# EAGLE design dfx-main (EAGLE 5.11)
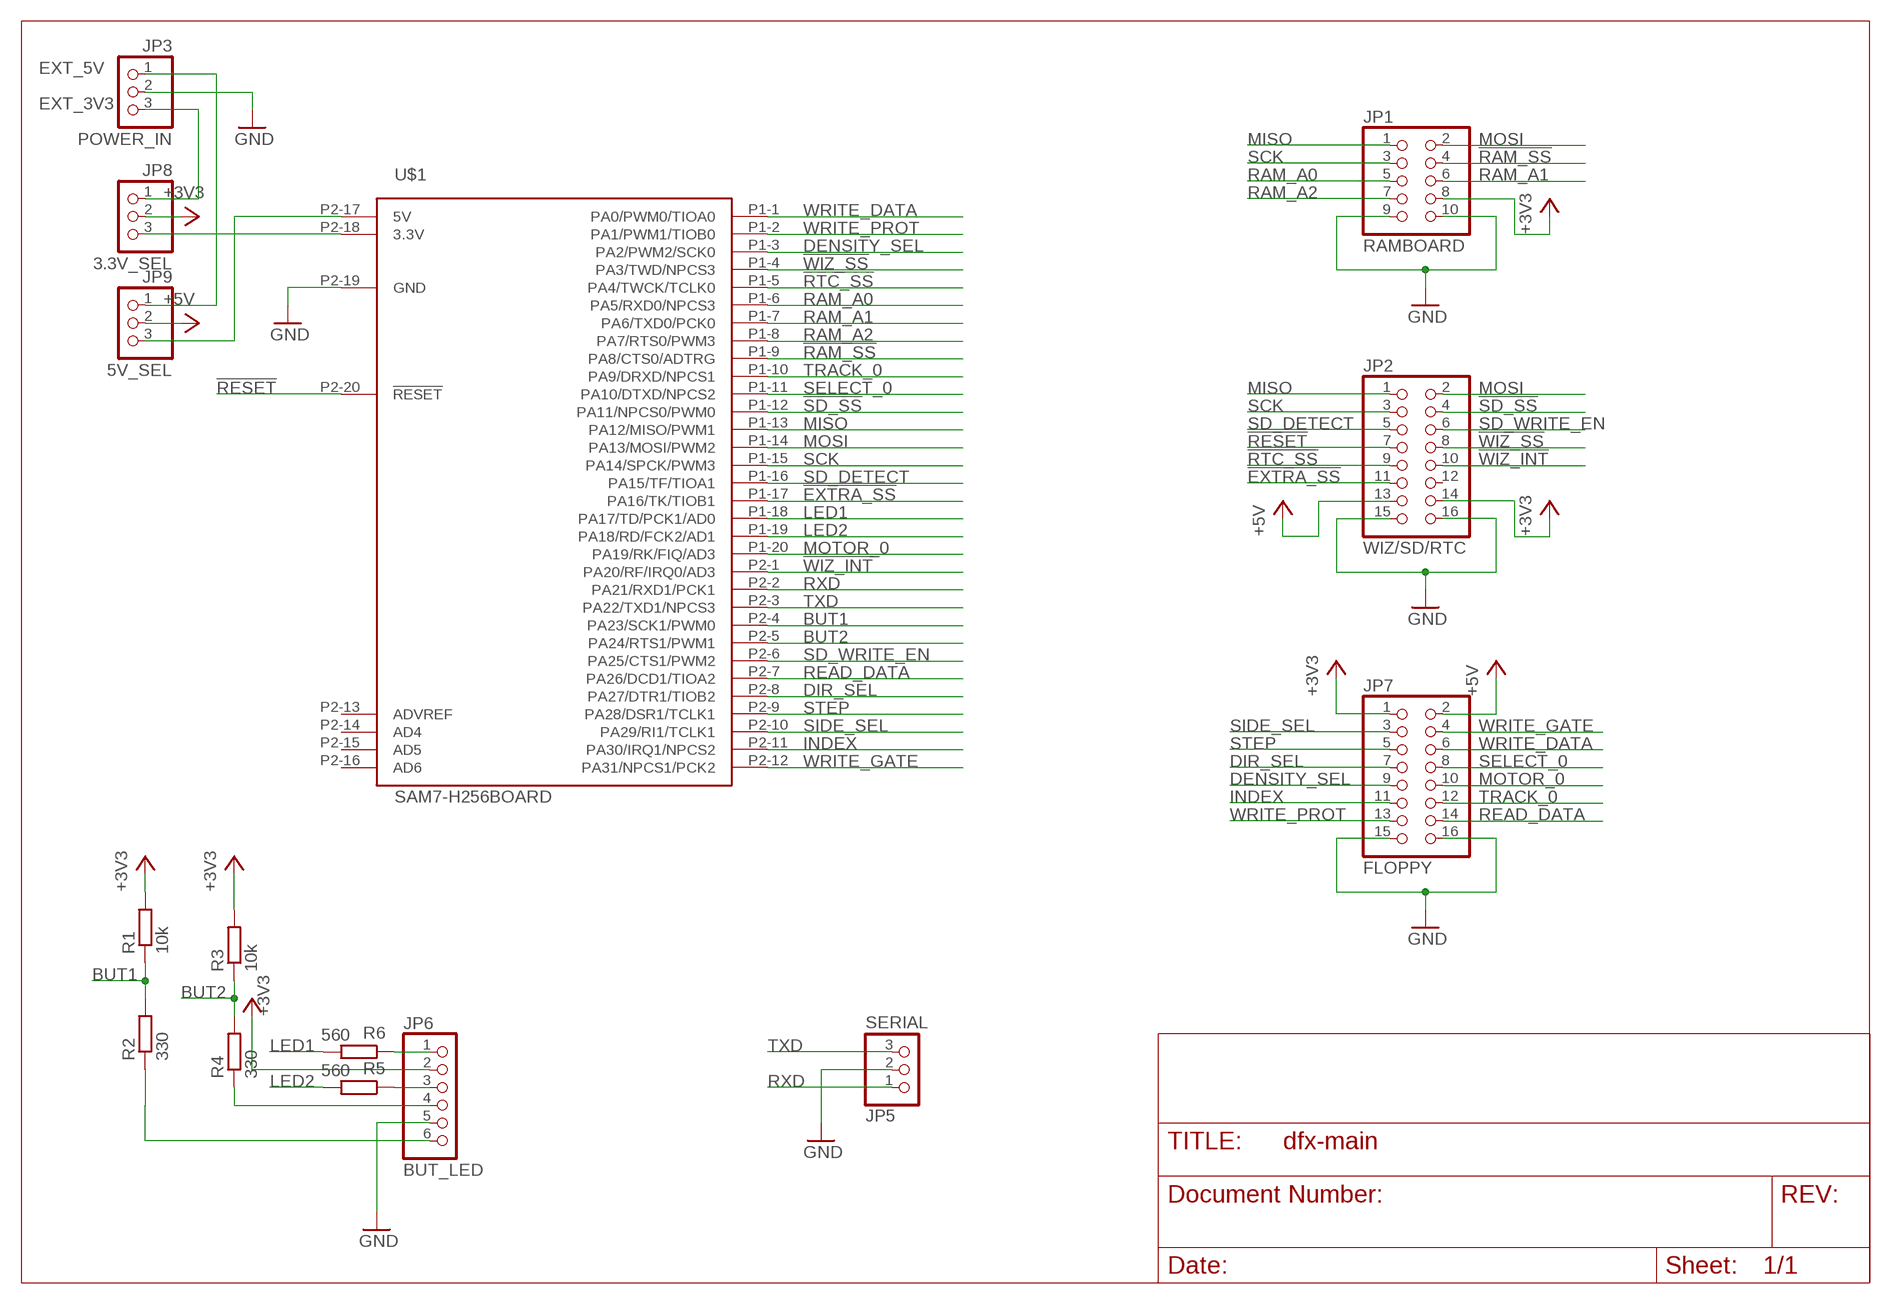
[diagram p0: schematic, sheet 1]

## Parts
JP1  RAMBOARD  PINHD-2X5  [2X05]
JP2  WIZ/SD/RTC  PINHD-2X8  [2X08]
JP3  POWER_IN  PINHD-1X3  [1X03]
JP5  SERIAL  PINHD-1X3  [1X03]
JP6  BUT_LED  PINHD-1X6  [1X06]
JP7  FLOPPY  PINHD-2X8  [2X08]
JP8  3.3V_SEL  PINHD-1X3  [1X03]
JP9  5V_SEL  PINHD-1X3  [1X03]
R1  10k  R-EU_R0805  [R0805]
R2  330  R-EU_R0805  [R0805]
R3  10k  R-EU_R0805  [R0805]
R4  330  R-EU_R0805  [R0805]
R5  560  R-EU_R0805  [R0805]
R6  560  R-EU_R0805  [R0805]
U$1  SAM7-H256BOARD  [SAM7-HXXX]

## Nets
!EXTRA_SS: JP2.11 U$1.P1-17(PA16/TK/TIOB1)
!RAM_SS: JP1.4 U$1.P1-9(PA8/CTS0/ADTRG)
!RESET: JP2.7 U$1.P2-20(!RESET)
!RTC_SS: JP2.9 U$1.P1-5(PA4/TWCK/TCLK0)
!SD_SS: JP2.4 U$1.P1-12(PA11/NPCS0/PWM0)
!WIZ_INT: JP2.10 U$1.P2-1(PA20/RF/IRQ0/AD3)
!WIZ_SS: JP2.8 U$1.P1-4(PA3/TWD/NPCS3)
+3V3 [POWER]: JP1.8 JP2.14 JP6.2 JP7.1 JP8.2 R1.2 R3.2
+5V [POWER]: JP2.13 JP7.2 JP9.2
BUT1: R1.1 R2.2 U$1.P2-4(PA23/SCK1/PWM0)
BUT2: R3.1 R4.2 U$1.P2-5(PA24/RTS1/PWM1)
DENSITY_SEL: JP7.9 U$1.P1-3(PA2/PWM2/SCK0)
DIR_SEL: JP7.7 U$1.P2-8(PA27/DTR1/TIOB2)
EXT_3V3 [POWER]: JP3.3 JP8.1
EXT_5V [POWER]: JP3.1 JP9.1
GND [POWER]: JP1.9 JP1.10 JP2.15 JP2.16 JP3.2 JP5.2 JP6.5 JP7.15 JP7.16 U$1.P2-19(GND)
INDEX: JP7.11 U$1.P2-11(PA30/IRQ1/NPCS2)
LED1: R6.2 U$1.P1-18(PA17/TD/PCK1/AD0)
LED2: R5.2 U$1.P1-19(PA18/RD/FCK2/AD1)
MISO: JP1.1 JP2.1 U$1.P1-13(PA12/MISO/PWM1)
MOSI: JP1.2 JP2.2 U$1.P1-14(PA13/MOSI/PWM2)
MOTOR_0: JP7.10 U$1.P1-20(PA19/RK/FIQ/AD3)
N$1 [POWER]: JP8.3 U$1.P2-18(3.3V)
N$3: JP6.6 R2.1
N$4: JP6.4 R4.1
N$5 [POWER]: JP9.3 U$1.P2-17(5V)
N$7: JP6.1 R6.1
N$8: JP6.3 R5.1
RAM_A0: JP1.5 U$1.P1-6(PA5/RXD0/NPCS3)
RAM_A1: JP1.6 U$1.P1-7(PA6/TXD0/PCK0)
RAM_A2: JP1.7 U$1.P1-8(PA7/RTS0/PWM3)
READ_DATA: JP7.14 U$1.P2-7(PA26/DCD1/TIOA2)
RXD: JP5.1 U$1.P2-2(PA21/RXD1/PCK1)
SCK: JP1.3 JP2.3 U$1.P1-15(PA14/SPCK/PWM3)
SD_DETECT: JP2.5 U$1.P1-16(PA15/TF/TIOA1)
SD_WRITE_EN: JP2.6 U$1.P2-6(PA25/CTS1/PWM2)
SELECT_0: JP7.8 U$1.P1-11(PA10/DTXD/NPCS2)
SIDE_SEL: JP7.3 U$1.P2-10(PA29/RI1/TCLK1)
STEP: JP7.5 U$1.P2-9(PA28/DSR1/TCLK1)
TRACK_0: JP7.12 U$1.P1-10(PA9/DRXD/NPCS1)
TXD: JP5.3 U$1.P2-3(PA22/TXD1/NPCS3)
WRITE_DATA: JP7.6 U$1.P1-1(PA0/PWM0/TIOA0)
WRITE_GATE: JP7.4 U$1.P2-12(PA31/NPCS1/PCK2)
WRITE_PROT: JP7.13 U$1.P1-2(PA1/PWM1/TIOB0)
Unconnected: JP2.12 U$1.P2-13(ADVREF) U$1.P2-14(AD4) U$1.P2-15(AD5) U$1.P2-16(AD6)

## Library data of the parts
JP1 = pinhead:PINHD-2X5: PIN HEADER
JP2 JP7 = pinhead:PINHD-2X8: PIN HEADER
JP3 JP5 JP8 JP9 = pinhead:PINHD-1X3: PIN HEADER
JP6 = pinhead:PINHD-1X6: PIN HEADER
R1-R6 = rcl:R-EU_: RESISTOR, European symbol
U$1 = cvlib:SAM7-H256

## Board
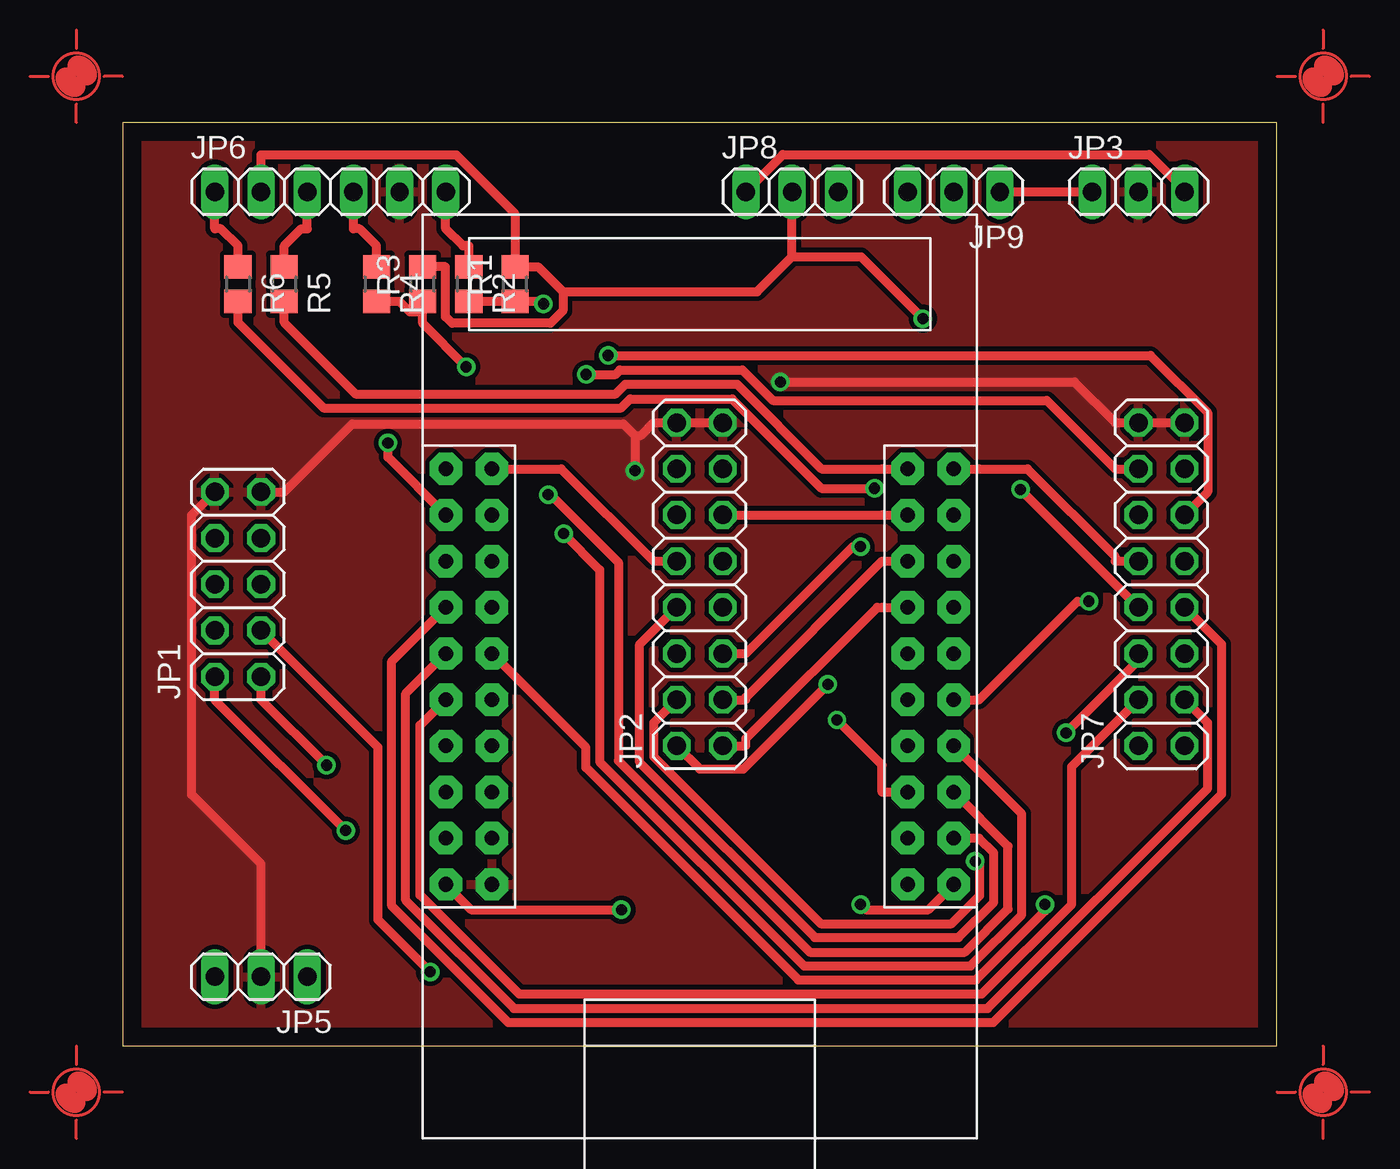
[diagram p1: board, top side]
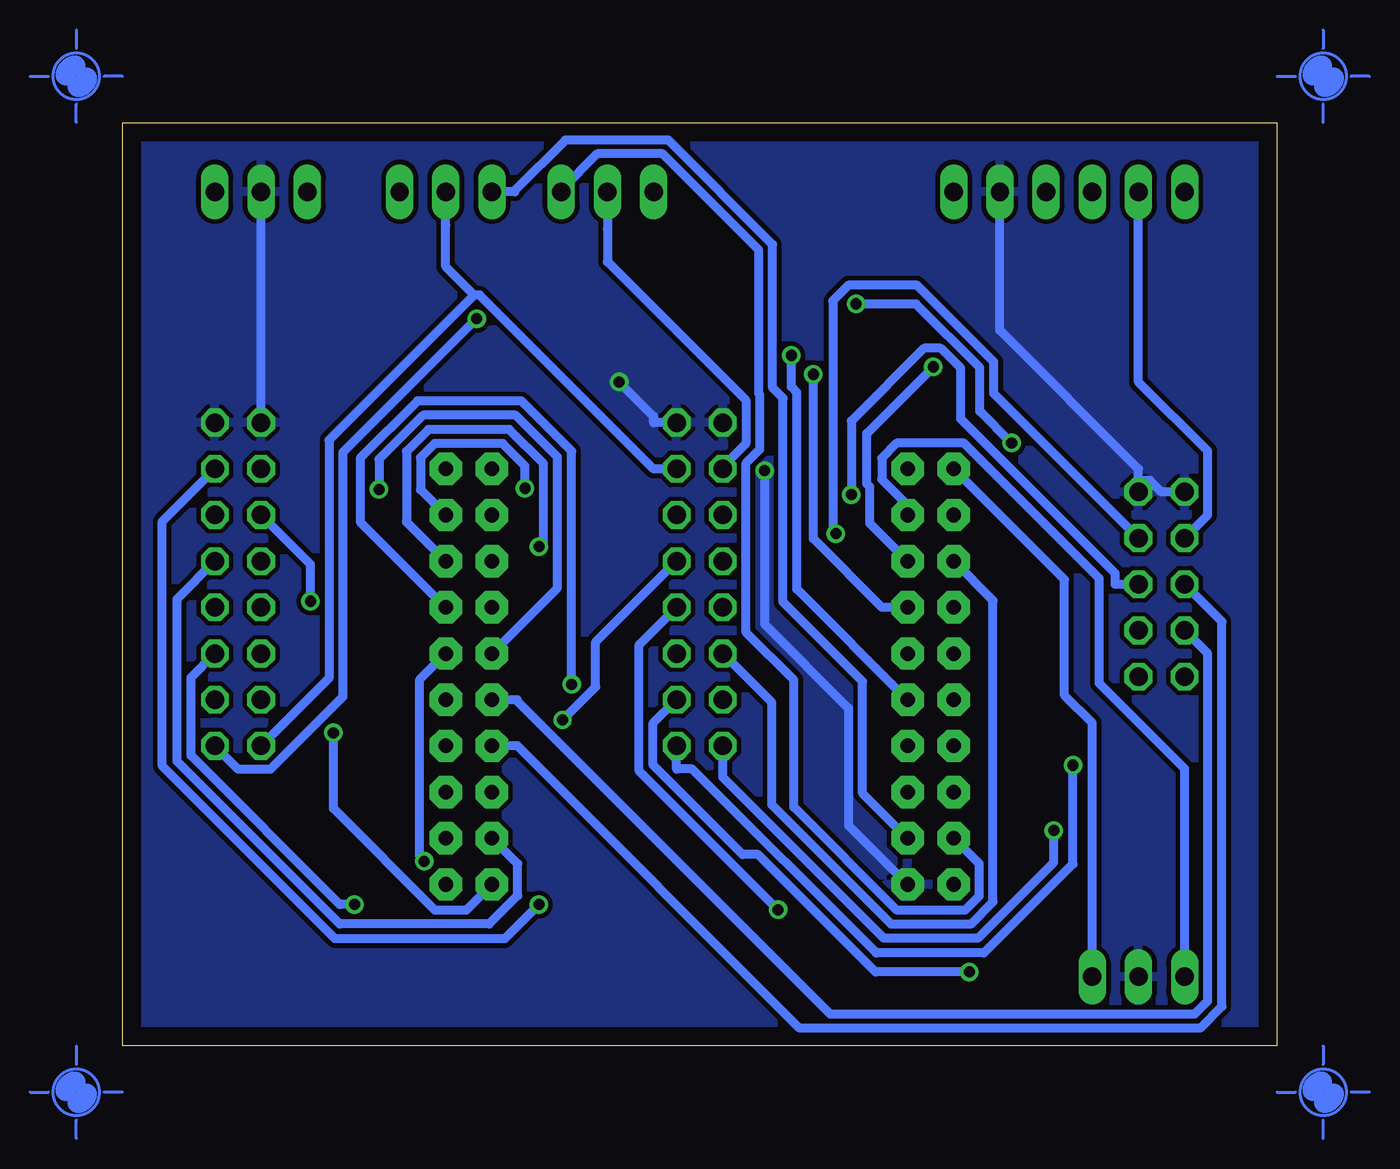
[diagram p2: board, bottom side, seen from below]

Size 63.5 x 50.79 mm. Coordinates in mm from the lower left corner, seen from the top.
Outline: 0,0 63.5,0 63.5,50.79 0,50.79 0,0
Copper layers (1*16): Top 0.035mm / dielectric 1.5mm / Bottom 0.035mm
Design rules "default *": minimum track width 20mil, minimum drill 24mil, track to track 10mil, track to pad 10mil, pad to pad 10mil, via to via 10mil, smd to smd 10mil, copper to edge 40mil, drill to drill 8mil, minimum pad ring 10mil, minimum via ring 8mil, stop-mask expansion 4mil, vias tented up to drill 0mil, thermal gap 10mil

### Footprints (pad centres in the part's own frame; a part is rotated, then mirrored left to right if it is on the bottom)
2X05 = drill 1.016 octagon: 1 -5.08,-1.27; 2 -5.08,1.27; 3 -2.54,-1.27; 4 -2.54,1.27; 5 0,-1.27; 6 0,1.27; 7 2.54,-1.27; 8 2.54,1.27; 9 5.08,-1.27; 10 5.08,1.27
2X08 = drill 1.016 octagon: 1 -8.89,-1.27; 2 -8.89,1.27; 3 -6.35,-1.27; 4 -6.35,1.27; 5 -3.81,-1.27; 6 -3.81,1.27; 7 -1.27,-1.27; 8 -1.27,1.27; 9 1.27,-1.27; 10 1.27,1.27; 11 3.81,-1.27; 12 3.81,1.27; 13 6.35,-1.27; 14 6.35,1.27; 15 8.89,-1.27; 16 8.89,1.27
1X03 = drill 1.016 long: 1 -2.54,0; 2 0,0; 3 2.54,0
1X06 = drill 1.016 long: 1 -6.35,0; 2 -3.81,0; 3 -1.27,0; 4 1.27,0; 5 3.81,0; 6 6.35,0
R0805 = smd 1.3 x 1.5: 1 -0.95,0; 2 0.95,0
SAM7-HXXX = drill 0.8 pad 1.778 octagon: P1-1 -11.43,11.43; P1-2 -13.97,11.43; P1-3 -11.43,8.89; P1-4 -13.97,8.89; P1-5 -11.43,6.35; P1-6 -13.97,6.35; P1-7 -11.43,3.81; P1-8 -13.97,3.81; P1-9 -11.43,1.27; P1-10 -13.97,1.27; P1-11 -11.43,-1.27; P1-12 -13.97,-1.27; P1-13 -11.43,-3.81; P1-14 -13.97,-3.81; P1-15 -11.43,-6.35; P1-16 -13.97,-6.35; P1-17 -11.43,-8.89; P1-18 -13.97,-8.89; P1-19 -11.43,-11.43; P1-20 -13.97,-11.43; P2-1 11.43,-11.43; P2-2 13.97,-11.43; P2-3 11.43,-8.89; P2-4 13.97,-8.89; P2-5 11.43,-6.35; P2-6 13.97,-6.35; P2-7 11.43,-3.81; P2-8 13.97,-3.81; P2-9 11.43,-1.27; P2-10 13.97,-1.27; P2-11 11.43,1.27; P2-12 13.97,1.27; P2-13 11.43,3.81; P2-14 13.97,3.81; P2-15 11.43,6.35; P2-16 13.97,6.35; P2-17 11.43,8.89; P2-18 13.97,8.89; P2-19 11.43,11.43; P2-20 13.97,11.43

### Placement (x,y rotation side)
JP1  6.35,25.4 90 top
JP2  31.75,25.4 90 top
JP3  55.88,46.99 0 top
JP5  7.62,3.81 180 top
JP6  11.43,46.99 0 top
JP7  57.15,25.4 90 top
JP8  36.83,46.99 0 top
JP9  45.72,46.99 180 top
R1  21.59,41.91 90 top
R2  19.05,41.91 270 top
R3  16.51,41.91 90 top
R4  13.97,41.91 270 top
R5  8.89,41.91 270 top
R6  6.35,41.91 270 top
U$1  31.75,20.32 180 top
U$2  [PASS-ROUND]  -2.54,53.34 0 top
U$3  [PASS-ROUND]  66.04,53.34 0 top
U$4  [PASS-ROUND]  66.04,-2.54 0 top
U$5  [PASS-ROUND]  -2.54,-2.54 0 top

### Tracks (layer width: path | path; a pad name or v marks a point on that pad's centre or on a via)
!EXTRA_SS
  Top 0.508: JP2.11 34.29,29.21 41.78,29.21 U$1.P1-17
!RAM_SS
  Bottom 0.508: JP1.4 3.81,21.59 3.81,2.48 4.54,1.75 24.57,1.75 41.78,18.96 41.78,19.05 U$1.P1-9
!RESET  (via drill 0.61 pad 1.02)
  Top 0.508: v27.45,7.49 19.18,7.49 U$1.P2-20
  Bottom 0.508: JP2.7 35.08,22.07 35.08,15.13 v27.45,7.49
!RTC_SS  (via drill 0.61 pad 1.02)
  Top 0.508: v39.3,17.94 41.78,15.45 41.78,13.97 U$1.P1-5
  Bottom 0.508: JP2.9 37.47,22.22 37.47,19.76 v39.3,17.94
!SD_SS  (via drill 0.61 pad 1.02)
  Top 0.508: v46.91,10.16 47.15,9.92 47.15,8.28 45.6,6.73 38.41,6.73 29.21,15.93 29.21,17.78 JP2.4
  Bottom 0.508: U$1.P1-12 47.16,20.15 47.16,10.4 v46.91,10.16
!WIZ_INT
  Top 0.508: JP2.10 29.21,26.67 24.13,31.75 U$1.P2-1
!WIZ_SS
  Top 0.508: JP2.8 28.45,22.1 28.45,15.6 38.08,5.96 45.99,5.96 47.93,7.91 47.93,10.62 47.12,11.43 U$1.P1-4
+3V3  (via drill 0.61 pad 1.02)
  Top 0.508: 24.22,41.49 22.85,42.86 R1.2 21.59,45.78 18.35,49.02 7.62,49.02 JP6.2 | 24.22,41.49 24.22,40.45 23.53,39.76 18.14,39.76 17.77,40.12 17.77,42.86 R3.2 | 24.22,41.49 34.9,41.49 36.83,43.41 | 36.83,43.41 40.62,43.41 v44.02,40.01 | 36.83,43.41 JP8.2
  Bottom 0.508: JP2.14 30.48,31.87 29.21,33.14 29.21,35.53 36.83,43.15 36.83,44.96 JP8.2 | v44.02,40.01 51.39,32.65 51.39,19.21 55.37,15.22 57.13,15.22 JP7.1 | JP6.2 7.62,36.53 3.81,32.72 3.81,29.21 JP1.8
+5V
  Bottom 0.508: 44.16,41.32 52.15,33.33 52.15,20.24 JP7.2 | 44.16,41.32 43.86,41.32 34.29,31.75 JP2.13 | 44.16,41.32 45.72,42.88 45.72,45.15 JP9.2
BUT1  (via drill 0.61 pad 1.02)
  Top 0.508: U$1.P2-4 14.6,32.4 v14.6,33.17 | v23.15,40.82 22.98,40.82 22.85,40.96 R1.1 20.31,40.96 R2.2
  Bottom 0.508: v23.15,40.82 19.86,40.82 16.34,37.31 16.34,34.92 v14.6,33.17
BUT2  (via drill 0.61 pad 1.02)
  Top 0.508: v18.91,37.36 16.51,39.76 16.51,40.38 | R4.2 15.23,40.96 15.81,40.38 16.51,40.38 | 16.51,40.38 R3.1
  Bottom 0.508: v18.91,37.36 22.57,33.7 22.57,30.92 22.4,30.75 22.4,28.75 U$1.P2-5
DENSITY_SEL
  Bottom 0.508: U$1.P1-3 41.77,10.02 41.77,8.27 43.33,6.71 51.55,6.71 60.5,15.66 60.5,24.59 JP7.9
DIR_SEL
  Top 0.508: JP7.7 60.45,22.09 60.45,13.86 47.89,1.3 21.22,1.3 14.81,7.71 14.81,21.16 U$1.P2-8
EXT_3V3
  Top 0.508: JP8.1 34.29,47.01 36.33,49.04 56.47,49.04 58.42,47.09 JP3.3
EXT_5V
  Top 0.508: JP9.1 JP3.1
GND  (via drill 0.61 pad 1.02)
  Top 0.508: 28.18,33.59 27.55,34.23 12.64,34.23 8.89,30.48 JP1.9 | 28.18,33.59 28.51,33.59 29.21,34.29 JP2.16 31.75,34.29 JP2.15 | 28.18,33.59 v28.18,31.65 | v36.19,36.53 52.37,36.53 54.61,34.29 JP7.16 JP7.15 | JP1.10 3.8,29.2 3.8,13.83 7.62,10.01 JP5.2
  Bottom 0.508: U$1.P2-19 23.56,12.13 23.56,18.58 28.18,23.21 v28.18,31.65 | JP2.15 34.29,34.29 34.29,34.63 v36.19,36.53 | JP1.10 6.35,30.48 6.99,31.11 7.62,31.11 | 7.62,31.11 7.62,31.75 15.24,39.37 JP6.5 | 7.62,31.11 JP1.9 | JP7.16 JP3.2
  pour Bottom: 0,50.8 63.5,50.8 63.5,0 0,0
  pour Top: 0,50.8 63.5,50.8 63.5,0 0,0
INDEX  (via drill 0.61 pad 1.02)
  Top 0.508: JP7.11 59.69,30.48 59.69,34.84 56.54,37.99 v26.71,37.99
  Bottom 0.508: U$1.P2-11 26.41,25.14 26.41,35.96 26.71,36.26 v26.71,37.99
LED1  (via drill 0.61 pad 1.02)
  Top 0.508: v41.36,30.68 38.45,30.68 33.53,35.59 27.93,35.59 27.43,35.1 11.05,35.1 6.35,39.8 R6.2
  Bottom 0.508: U$1.P1-18 47.12,30.61 47.12,32.37 46.34,33.15 42.59,33.15 41.36,31.92 v41.36,30.68
LED2
  Top 0.508: R5.2 8.89,39.8 12.82,35.87 27.13,35.87 27.66,36.41 33.8,36.41 38.46,31.75 41.78,31.75 U$1.P1-19
MISO  (via drill 0.61 pad 1.02)
  Top 0.508: v11.22,15.45 7.62,19.05 JP1.1 | JP2.1 34.29,16.51 34.29,16.91 41.51,24.13 41.78,24.13 U$1.P1-13
  Bottom 0.508: v11.22,15.45 11.22,10.02 16.12,5.11 22.04,5.11 32.17,15.24 33.02,15.24 JP2.1
MOSI  (via drill 0.61 pad 1.02)
  Top 0.508: JP2.2 31.75,15.24 34.15,15.24 v38.8,19.89 | v12.28,11.85 5.08,19.05 JP1.2
  Bottom 0.508: U$1.P1-14 50.42,28.83 50.42,32.34 47.27,35.48 41.56,35.48 38.8,32.73 v38.8,19.89 | v12.28,11.85 12.28,10.11 16.45,5.93 21.63,5.93 30.48,14.79 30.48,15.24 JP2.2
MOTOR_0
  Top 0.508: U$1.P1-20 47.12,31.75 49.78,31.75 54.61,26.92 54.61,26.67 JP7.10
N$1
  Bottom 0.508: U$1.P2-18 16.38,10.03 16.38,8.25 17.16,7.46 20.89,7.46 26.57,13.14 26.57,20.13 29.2,22.76 29.2,32.07 28.44,32.83 28.44,35.84 28.5,35.9 28.5,43.78 33.8,49.08 37.39,49.08 39.37,47.09 JP8.3
N$3
  Top 0.508: R2.1 19.05,44.02 18.72,44.02 17.78,44.96 JP6.6
N$4
  Top 0.508: JP6.4 12.7,44.96 13.03,44.96 13.97,44.02 R4.1
N$5
  Bottom 0.508: U$1.P2-17 22.8,13.9 22.8,20.05 27.17,24.42 27.17,35.64 27.74,36.21 27.74,44.09 33.48,49.84 39.14,49.84 41.91,47.07 41.91,46.99 JP9.3
N$7
  Top 0.508: JP6.1 5.08,44.96 5.41,44.96 6.35,44.02 R6.1
N$8
  Top 0.508: JP6.3 10.16,44.96 9.83,44.96 8.89,44.02 R5.1
RAM_A0  (via drill 0.61 pad 1.02)
  Top 0.508: U$1.P1-6 48.7,10.99 48.7,7.54 46.32,5.16 37.81,5.16 27.28,15.69 27.28,26.6 23.55,30.33 v23.41,30.33
  Bottom 0.508: JP1.5 8.89,25.4 8.89,25.99 17.4,34.5 17.4,37.28 18.49,38.38 19.42,38.38 23.41,34.39 v23.41,30.33
RAM_A1
  Bottom 0.508: U$1.P1-7 41.78,16.51 26.25,0.98 4.23,0.98 3.03,2.18 3.03,23.35 JP1.6
RAM_A2  (via drill 0.61 pad 1.02)
  Top 0.508: U$1.P1-8 49.46,12.77 49.46,7.22 46.64,4.4 37.49,4.4 26.25,15.64 26.25,26.2 v24.26,28.18
  Bottom 0.508: v24.26,28.18 24.43,28.35 24.43,41 23.58,41.85 19.8,41.85 15.58,37.62 15.58,35.9 JP1.7
READ_DATA  (via drill 0.61 pad 1.02)
  Top 0.508: v25.5,36.95 27.12,36.95 27.36,37.19 34.1,37.19 35.77,35.52 50.84,35.52 54.61,31.75 JP7.14
  Bottom 0.508: v25.5,36.95 25.5,27.91 21.72,24.13 U$1.P2-7
RXD
  Bottom 0.508: U$1.P2-2 11.68,25.65 11.68,19.29 10.16,17.76 10.16,5.84 JP5.1
SCK  (via drill 0.61 pad 1.02)
  Top 0.508: JP1.3 14.05,16.43 14.05,6.94 v16.92,4.07 | JP2.3 34.29,19.05 34.29,19.18 41.78,26.67 U$1.P1-15
  Bottom 0.508: JP2.3 34.31,17.76 34.31,15.45 29.39,10.53 28.54,10.53 22.08,4.07 v16.92,4.07
SD_DETECT  (via drill 0.61 pad 1.02)
  Top 0.508: v40.6,27.47 40.17,27.47 34.29,21.59 JP2.5
  Bottom 0.508: v40.6,27.47 40.35,27.72 40.35,32.03 42.23,33.91 46.67,33.91 47.88,32.71 47.88,28.83 U$1.P1-16
SD_WRITE_EN
  Bottom 0.508: U$1.P2-6 15.61,24.5 15.61,7.93 16.84,6.7 21.21,6.7 27.78,13.28 27.78,18.89 JP2.6
SELECT_0  (via drill 0.61 pad 1.02)
  Top 0.508: v49.39,30.62 JP7.8
  Bottom 0.508: U$1.P1-11 39.57,25.2 39.57,32.4 41.88,34.7 46.97,34.7 49.39,32.28 v49.39,30.62
SIDE_SEL
  Top 0.508: U$1.P2-10 15.58,19.39 15.58,8.02 21.54,2.06 47.58,2.06 59.69,14.18 59.69,17.78 JP7.3
STEP  (via drill 0.61 pad 1.02)
  Top 0.508: v50.74,7.79 50.74,7.42 46.95,3.63 37.18,3.63 25.49,15.32 25.49,16.42 U$1.P2-9
  Bottom 0.508: JP7.5 59.74,20.27 59.74,15.98 51.55,7.79 v50.74,7.79
TRACK_0  (via drill 0.61 pad 1.02)
  Top 0.508: U$1.P1-10 47.12,19.05 52.53,24.46 v53.16,24.46
  Bottom 0.508: v53.16,24.46 53.16,26.5 JP7.12
TXD
  Bottom 0.508: JP5.3 5.08,15.25 9.78,19.95 9.78,25.73 17.21,33.16 20.92,33.16 21.74,32.34 21.74,31.17 20.32,29.75 U$1.P2-3
WRITE_DATA  (via drill 0.61 pad 1.02)
  Top 0.508: v51.9,17.23 55.88,21.21 JP7.6
  Bottom 0.508: U$1.P1-1 44.6,7.47 46.31,7.47 51.9,13.06 v51.9,17.23
WRITE_GATE
  Top 0.508: JP7.4 52.21,15.38 52.21,7.8 47.27,2.87 21.81,2.87 16.36,8.31 16.36,17.64 U$1.P2-12
WRITE_PROT  (via drill 0.61 pad 1.02)
  Top 0.508: U$1.P1-2 44.32,7.49 40.89,7.49 v40.6,7.79
  Bottom 0.508: v40.6,7.79 42.49,5.9 51.81,5.9 61.31,15.4 61.31,28.86 JP7.13